# Altium project UdemyCourse.PrjPcb
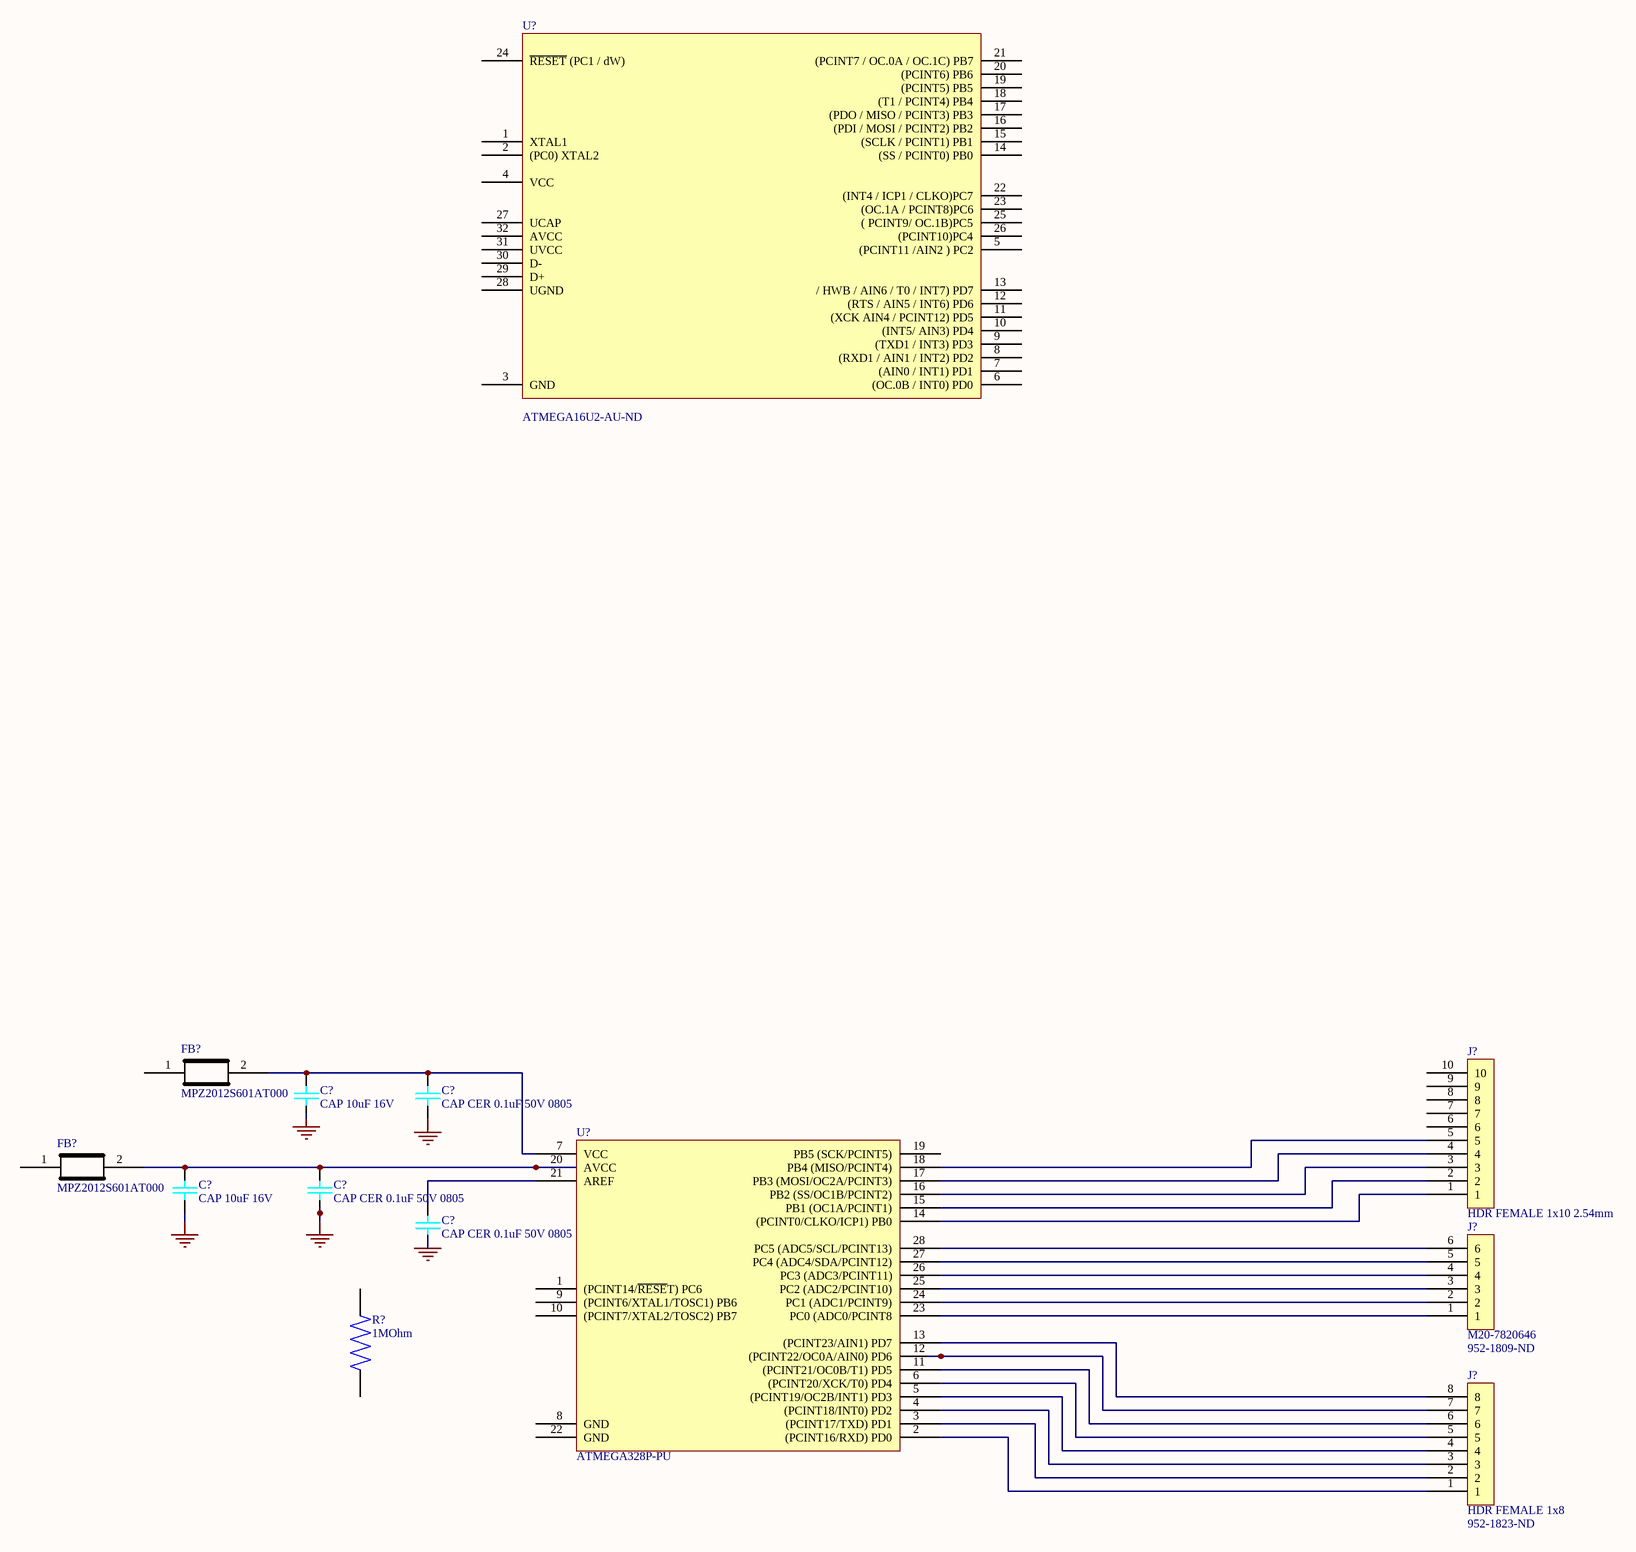
[diagram p0: 28Pins.SchDoc]
1 sheet, 13 parts. Net scope: global (net labels, ports and power ports of the same name join across sheets).
Board file: 28Pin_PCB.PcbDoc

## Sheet 28Pins.SchDoc
size A0

### Parts
(Parts that share a designator on the sheet are numbered #1, #2 ... from top to bottom, then left to right.)
C?#1  CAP 10uF 16V  [C0805_10uF]
C?#2  CAP CER 0.1uF 50V 0805  [C0805]
C?#3  CAP 10uF 16V  [C0805_10uF]
C?#4  CAP CER 0.1uF 50V 0805  [C0805]
C?#5  CAP CER 0.1uF 50V 0805  [C0805]
FB?#1  MPZ2012S601AT000  [C0805]
FB?#2  MPZ2012S601AT000  [C0805]
J?#1  HDR FEMALE 1x10 2.54mm  [HDR_FEMALE_1x10 - duplicate]
J?#2  M20-7820646  Supplier Part Number 1: 952-1809-ND
J?#3  HDR FEMALE 1x8  Supplier Part Number 1: 952-1823-ND  [HDR_FEMALE_1x8]
R?  1MOhm  [RESC2012X65N]
U?#1  Supplier Part Number 1: ATMEGA16U2-AU-ND  [TQFP32]
U?#2  ATMEGA328P-PU  [DIP28_328P]

### Nets
GND: C?#1.1 C?#3.1 C?#4.1 C?#5.1
k: C?#2.1
NetC?#1_2: C?#1.2 C?#2.2 FB?#1.2 U?#2.7(VCC)
NetC?#3_2: C?#3.2 C?#4.2 FB?#2.2 U?#2.20(AVCC)
NetC?#5_2: C?#5.2 U?#2.21(AREF)
NetJ?#1_1: J?#1.1 U?#2.14((PCINT0/CLKO/ICP1)_PB0)
NetJ?#1_2: J?#1.2 U?#2.15(PB1_(OC1A/PCINT1))
NetJ?#1_3: J?#1.3 U?#2.16(PB2_(SS/OC1B/PCINT2))
NetJ?#1_4: J?#1.4 U?#2.17(PB3_(MOSI/OC2A/PCINT3))
NetJ?#1_5: J?#1.5 U?#2.18(PB4_(MISO/PCINT4))
NetJ?#2_1: J?#2.1 U?#2.23(PC0_(ADC0/PCINT8)
NetJ?#2_2: J?#2.2 U?#2.24(PC1_(ADC1/PCINT9))
NetJ?#2_3: J?#2.3 U?#2.25(PC2_(ADC2/PCINT10))
NetJ?#2_4: J?#2.4 U?#2.26(PC3_(ADC3/PCINT11))
NetJ?#2_5: J?#2.5 U?#2.27(PC4_(ADC4/SDA/PCINT12))
NetJ?#2_6: J?#2.6 U?#2.28(PC5_(ADC5/SCL/PCINT13))
NetJ?#3_1: J?#3.1 U?#2.2((PCINT16/RXD)_PD0)
NetJ?#3_2: J?#3.2 U?#2.3((PCINT17/TXD)_PD1)
NetJ?#3_3: J?#3.3 U?#2.4((PCINT18/INT0)_PD2)
NetJ?#3_4: J?#3.4 U?#2.5((PCINT19/OC2B/INT1)_PD3)
NetJ?#3_5: J?#3.5 U?#2.6((PCINT20/XCK/T0)_PD4)
NetJ?#3_6: J?#3.6 U?#2.11((PCINT21/OC0B/T1)_PD5)
NetJ?#3_7: J?#3.7 U?#2.12((PCINT22/OC0A/AIN0)_PD6)
NetJ?#3_8: J?#3.8 U?#2.13((PCINT23/AIN1)_PD7)

Not connected (* = marked no-connect by the designer): FB?#1 1; FB?#2 1; J?#1 6 7 8 9 10; R? 1 2; U?#1 1(XTAL1) 2((PC0)_XTAL2) 3(GND) 4(VCC) 5((PCINT11_/AIN2_)_PC2) 6((OC.0B_/_INT0)_PD0) 7((AIN0_/_INT1)_PD1) 8((RXD1_/_AIN1_/_INT2)_PD2) 9((TXD1_/_INT3)_PD3) 10((INT5/_AIN3)_PD4) 11((XCK_AIN4_/_PCINT12)_PD5) 12((RTS_/_AIN5_/_INT6)_PD6) 13(/_HWB_/_AIN6_/_T0_/_INT7)_PD7) 14((SS_/_PCINT0)_PB0) 15((SCLK_/_PCINT1)_PB1) 16((PDI_/_MOSI_/_PCINT2)_PB2) 17((PDO_/_MISO_/_PCINT3)_PB3) 18((T1_/_PCINT4)_PB4) 19((PCINT5)_PB5) 20((PCINT6)_PB6) 21((PCINT7_/_OC.0A_/_OC.1C)_PB7) 22((INT4_/_ICP1_/_CLKO)PC7) 23((OC.1A_/_PCINT8)PC6) 24(~{RESET}_(PC1_/_dW)) 25((_PCINT9/_OC.1B)PC5) 26((PCINT10)PC4) 27(UCAP) 28(UGND) 29(D+) 30(D-) 31(UVCC) 32(AVCC); U?#2 1((PCINT14/~{RESE}T)_PC6) 8(GND) 9((PCINT6/XTAL1/TOSC1)_PB6) 10((PCINT7/XTAL2/TOSC2)_PB7) 19(PB5_(SCK/PCINT5)) 22(GND)

### Library data of the parts
C?#1 C?#3 = CGA4J1X5R1C106K125AC: TDK - CGA4J1X5R1C106K125AC - Keramikvielschichtkondensator, SMD, 10 µF, 16 V, 0805 [Metrisch 2012], ± 10%, X5R, Baureihe CGA; Supplier 1: Digi-Key; Manufacturer: TDK; Manufacturer Part Number: CGA4J1X5R1C106K125AC; RoHS: Yes; Category: Ceramic Capacitors; Stock 1: 1670; Pricing 1: 1=0.48000, 10=0.33000, 50=0.23100, 100=0.19800, 500=0.14850, 1000=0.12540 (USD); Mount: Surface Mount; Case/Package: 0805; Case Code (Metric): 2012; Case Code (Imperial): 0805; Weight: 0.000194oz; Min Operating Temperature: -55°C; Max Operating Temperature: 85°C; Capacitance: 10uF; Tolerance: 10%; Voltage Rating: 16V; Package Quantity: 1; Packaging: Tape and Reel; Voltage Rating (DC): 16V; Dielectric: X5R; Termination: SMD/SMT; Resistor Type: Ceramic; Series: CGA; Length: 2mm; Width: 0.049inch; Height: 1.25mm; Thickness: 0.049inch; Depth: 1.25mm; Ratings: AEC-Q200; REACH SVHC: No SVHC; Lead Free: Lead Free; RoHS Compliant: Yes; ComponentLink1URL: https://datasheet.ciiva.com/24216/cga4j1x5r1c106k125ac-265827-24216314.pdf?src-supplier=Mouser; ComponentLink1Description: https://datasheet.ciiva.com/24216/cga4j1x5r1c106k125ac-265827-24216314.pdf?src-supplier=Mouser; ComponentLink2URL: https://datasheet.ciiva.com/7975/1807242-7975419.pdf?src-supplier=Element14; ComponentLink2Description: https://datasheet.ciiva.com/7975/1807242-7975419.pdf?src-supplier=Element14; Supplier Part Number 1: 445-7883-1-ND
C?#2 C?#4 C?#5 = CGA4J2X7R1H104K125AE: CAP CER 0.1UF 50V X7R 0805; Manufacturer: TDK; Capacitance: 100nF; Tolerance: 10%; Supplier 1: Digi-Key; Manufacturer Part Number: CGA4J2X7R1H104K125AE; RoHS: Yes; Category: Ceramic Capacitors; Stock 1: 29752; Pricing 1: 1=0.26000, 10=0.18200, 50=0.12100, 100=0.10280, 500=0.07260, 1000=0.06352 (USD); Mount: Surface Mount; Case/Package: 0805; Case Code (Metric): 2012; Case Code (Imperial): 0805; Min Operating Temperature: -55°C; Max Operating Temperature: 125°C; Package Quantity: 1; Packaging: Tape and Reel; Voltage Rating: 50V; Features: Soft Termination; Length: 0.079inch; Width: 0.049inch; Thickness: 0.057inch; Ratings: AEC-Q200; Lead Free: Lead Free; RoHS Compliant: Yes; ComponentLink1URL: http://product.tdk.com/en/catalog/datasheets/mlcc_automotive_soft_en.pdf?src-supplier=Avnet; ComponentLink1Description: http://product.tdk.com/en/catalog/datasheets/mlcc_automotive_soft_en.pdf?src-supplier=Avnet; ComponentLink2URL: https://product.tdk.com/info/en/catalog/datasheets/mlcc_automotive_soft_en.pdf?src-supplier=Digi-Key; ComponentLink2Description: https://product.tdk.com/info/en/catalog/datasheets/mlcc_automotive_soft_en.pdf?src-supplier=Digi-Key; ComponentLink3URL: https://product.tdk.com/info/en/catalog/spec/mlccspec_automotive_soft_en.pdf?src-supplier=Digi-Key; ComponentLink3Description: https://product.tdk.com/info/en/catalog/spec/mlccspec_automotive_soft_en.pdf?src-supplier=Digi-Key; Supplier Part Number 1: 445-15959-1-ND
FB?#1 FB?#2 = MPZ2012S601AT000: FERRITE BEAD 600 OHM 0805 1LN; Manufacturer: TDK; Impedance: 600R; Current Rating: 2A; DC Resistance (DCR): 100mR; Supplier 1: Digi-Key; Manufacturer Part Number: MPZ2012S601AT000; RoHS: Yes; Category: Ferrite Beads and Chips; Pricing 1: 1=0.11000, 10=0.09200, 25=0.08240, 50=0.06040, 100=0.05220, 250=0.04116, 500=0.03476, 1000=0.02928 (USD); Mount: Surface Mount; Case/Package: 0805; Case Code (Metric): 2012; Case Code (Imperial): 0805; Packaging: Tape and Reel; Package Quantity: 1; Max DC Current: 2A; Series: MPZ; Length: 0.079inch; Width: 0.049inch; Height: 0.041inch; REACH SVHC: No SVHC; Lead Free: Lead Free; RoHS Compliant: Yes; ComponentLink1URL: https://datasheet.ciiva.com/46634/beads-commercial-power-mpz-en-46634377.pdf?src-supplier=Digi-Key; ComponentLink1Description: https://datasheet.ciiva.com/46634/beads-commercial-power-mpz-en-46634377.pdf?src-supplier=Digi-Key; ComponentLink2URL: https://datasheet.ciiva.com/46634/beads-commercial-power-mpz-en-46634606.pdf?src-supplier=Digi-Key; ComponentLink2Description: https://datasheet.ciiva.com/46634/beads-commercial-power-mpz-en-46634606.pdf?src-supplier=Digi-Key; ComponentLink3URL: https://datasheet.ciiva.com/46634/beads-commercial-power-mpz-en-46634335.pdf?src-supplier=Digi-Key; ComponentLink3Description: https://datasheet.ciiva.com/46634/beads-commercial-power-mpz-en-46634335.pdf?src-supplier=Digi-Key; Supplier Part Number 1: 445-2206-1-ND
J?#1 = 952-3580-ND (female header 10pin): Supplier 1: Digi-Key; Supplier Part Number 1: 952-1847-ND
J?#2 = M20-7820646: 06-WAY SIL VERT SOCKET L/FREE; Manufacturer: Harwin; Number of Contacts: 6; Max Current Rating: 3A; Contact Resistance: 20mR; Connector Type: Receptacle; Gender: Female; Pitch: 2.54mm; Supplier 1: Digi-Key; Manufacturer Part Number: M20-7820646; RoHS: Yes; Category: Headers and Wire Housings; Stock 1: 1269; Pricing 1: 1=1.02000, 10=0.89900, 100=0.77550, 500=0.63448, 1000=0.56398, 5000=0.49349, 10000=0.46881 (USD); Mount: Through Hole; Case/Package: SIL; Color: Black; Contact Plating: Tin; Contact Material: Bronze; Housing Color: Black; Housing Material: Nylon; Min Operating Temperature: -40°C; Max Operating Temperature: 105°C; Number of Rows: 1; Termination: Solder; Packaging: Rail/Tube; Contact Gender: Female; Package Quantity: 38; Number of Positions: 6; Orientation: Straight; Series: M20; Contact Type: Female Socket; Length: 15.64mm; Depth: 2.5mm; Radiation Hardening: No; RoHS Compliant: Yes; ComponentLink1URL: http://components.arrow.com/part/dataview/0323_00725884?src-supplier=Arrow+Europe; ComponentLink1Description: http://components.arrow.com/part/dataview/0323_00725884?src-supplier=Arrow+Europe; ComponentLink2URL: http://www.harwin.com/include/downloads/pdfs/2010PAGE120.PDF?src-supplier=Avnet; ComponentLink2Description: http://www.harwin.com/include/downloads/pdfs/2010PAGE120.PDF?src-supplier=Avnet; ComponentLink3URL: https://cdn.harwin.com/pdfs/M20-782.pdf?src-supplier=Digi-Key; ComponentLink3Description: https://cdn.harwin.com/pdfs/M20-782.pdf?src-supplier=Digi-Key; ComponentLink4URL: https://cdn.harwin.com/pdfs/Harwin_PC_Connectors_M20.pdf?src-supplier=Avnet+Europe; ComponentLink4Description: https://cdn.harwin.com/pdfs/Harwin_PC_Connectors_M20.pdf?src-supplier=Avnet+Europe; ComponentLink5URL: https://cdn.harwin.com/pdfs/Harwin_PC_Connectors_M20.pdf?src-supplier=RSComponents; ComponentLink5Description: https://cdn.harwin.com/pdfs/Harwin_PC_Connectors_M20.pdf?src-supplier=RSComponents; ComponentLink6URL: https://cdn.harwin.com/pdfs/Harwin_PC_Connectors_M20.pdf?src-supplier=Mouser; ComponentLink6Description: https://cdn.harwin.com/pdfs/Harwin_PC_Connectors_M20.pdf?src-supplier=Mouser; ComponentLink7URL: https://cdn.harwin.com/pdfs/Harwin_PC_Connectors_M20.pdf?src-supplier=TTI; ComponentLink7Description: https://cdn.harwin.com/pdfs/Harwin_PC_Connectors_M20.pdf?src-supplier=TTI
J?#3 = M20-7821046: HARWIN - M20-7821046 - Board-To-Board Connector, M20 Series, Through Hole, Receptacle, 10, 2.54 mm, Tin Plated Contacts; Connector Type: Receptacle,Socket; Number of Positions: 10; Current Rating: 3A; Insulation Resistance: 1MR; Contact Resistance: 20mR; Mating Cycles: 50; Pitch: 2.54mm; Hole Diameter: 0.8mm; Manufacturer: Harwin; Manufacturer Part Number: M20-7821046; RoHS: Yes; Category: Headers and Wire Housings; Stock 1: 664; Pricing 1: 1=1.29000, 10=1.13300, 100=0.97770, 500=0.79992, 1000=0.71104, 5000=0.62216, 10000=0.59105 (USD); Mount: Through Hole; Case/Package: SIL; Color: Black; Contact Plating: Tin; Contact Material: Bronze; Housing Material: Polyamide; Housing Color: Black; Min Operating Temperature: -40°C; Max Operating Temperature: 105°C; Termination: Solder; Packaging: Rail/Tube; Number of Rows: 1; Package Quantity: 23; Number of Contacts: 10; Gender: Receptacle; Orientation: Straight; Max Current Rating: 3A; Contact Gender: Female; Length: 25.8mm; Depth: 2.5mm; Lead Pitch: 2.54mm; Radiation Hardening: No; REACH SVHC: No SVHC; ComponentLink1URL: https://datasheet.ciiva.com/26899/getdatasheetpartid-559226-26899379.pdf?src-supplier=Verical; ComponentLink1Description: https://datasheet.ciiva.com/26899/getdatasheetpartid-559226-26899379.pdf?src-supplier=Verical; ComponentLink2URL: https://datasheet.ciiva.com/11753/0900766b80dc1d2b-11753869.pdf?src-supplier=RSComponents; ComponentLink2Description: https://datasheet.ciiva.com/11753/0900766b80dc1d2b-11753869.pdf?src-supplier=RSComponents; ComponentLink3URL: https://datasheet.ciiva.com/6785/m20-782-6785605.pdf?src-supplier=Digi-Key; ComponentLink3Description: https://datasheet.ciiva.com/6785/m20-782-6785605.pdf?src-supplier=Digi-Key; ComponentLink4URL: https://datasheet.ciiva.com/10151/m20-782-10151366.pdf?src-supplier=Avnet; ComponentLink4Description: https://datasheet.ciiva.com/10151/m20-782-10151366.pdf?src-supplier=Avnet; ComponentLink5URL: https://datasheet.ciiva.com/16732/m20-782-16732152.pdf?src-supplier=Avnet+Europe; ComponentLink5Description: https://datasheet.ciiva.com/16732/m20-782-16732152.pdf?src-supplier=Avnet+Europe; Supplier 1: Digi-Key
R? = RMCF0805FG1M00: Package: None; Price: None; Value: *; MP: RMCF0805FG1M00; Availability: Unavailable; Supplier 1: Digi-Key; Supplier Part Number 1: RMCF0805FG1M00CT-ND
U?#1 = ATMEGA16U2-AU: MICROCHIP - ATMEGA16U2-AU - MCU, 8BIT, MEGAAVR, 16MHZ, TQFP-32; Manufacturer: Microchip / Atmel; Core Architecture: AVR; Interface: SPI,UART,USB,USART,Serial; Data Bus Width: 8b; Memory Type: FLASH; Memory Size: 16KB; RAM Size: 512B; Number of I/Os: 22; Number of Timers/Counters: 2; Max Supply Voltage: 5.5V; Min Supply Voltage: 2.7V; Oscillator Type: Internal; Watchdog Timer: Yes; Peripherals: Brown-out Detect/Reset,POR,PWM,WDT; Number of PWM Channels: 5; Number of SPI Channels: 1; Supplier 1: Digi-Key; Manufacturer Part Number: ATMEGA16U2-AU; RoHS: Yes; Category: Microcontrollers; Stock 1: 4215; Pricing 1: 1=2.83000, 25=2.59600, 100=2.35400 (USD); Mount: Surface Mount; Case/Package: A; Number of Pins: 32; Min Operating Temperature: -40°C; Max Operating Temperature: 85°C; Package Quantity: 1250; Frequency: 16MHz; Packaging: Tray; Number of Programmable I/O: 22; Max Frequency: 16MHz; Series: AVR® ATmega; Length: 7mm; Width: 7mm; Height: 1.05mm; REACH SVHC: No SVHC; Lead Free: Lead Free; RoHS Compliant: Yes; ComponentLink1URL: https://datasheet.ciiva.com/13036/doc7799-28769-13036800.pdf?src-supplier=Mouser; ComponentLink1Description: https://datasheet.ciiva.com/13036/doc7799-28769-13036800.pdf?src-supplier=Mouser; ComponentLink2URL: https://datasheet.ciiva.com/22651/doc7799-22651110.pdf?src-supplier=Farnell; ComponentLink2Description: https://datasheet.ciiva.com/22651/doc7799-22651110.pdf?src-supplier=Farnell; Contact Plating: Tin,Matte
U?#2 = ATMEGA328P-PU: IC MCU 8BIT 32KB FLASH 28DIP; Manufacturer: Microchip / Atmel; Core Architecture: AVR; Number of I/Os: 23; Frequency: 20MHz; Oscillator Type: Internal; Peripherals: Brown-out Detect/Reset,POR,PWM,WDT; Interface: I2C,SPI,UART,USART,2-Wire; RAM Size: 2KB; Number of Timers/Counters: 3; Min Supply Voltage: 1.8V; Max Supply Voltage: 5.5V; Data Bus Width: 8b; Watchdog Timer: Yes; Number of PWM Channels: 6; Number of SPI Channels: 1; Supplier 1: Digi-Key; Manufacturer Part Number: ATMEGA328P-PU; RoHS: Yes; Category: Microcontrollers; Stock 1: 54032; Pricing 1: 1=2.52000, 25=2.31000, 100=2.09000 (USD); Mount: Through Hole; Case/Package: PDIP; Number of Pins: 28; Contact Plating: Tin,Matte; Min Operating Temperature: -40°C; Max Operating Temperature: 85°C; Packaging: Rail/Tube; Memory Type: FLASH; Memory Size: 32KB; Package Quantity: 14; Number of Programmable I/O: 23; Max Frequency: 20MHz; Series: AVR® ATmega; Number of ADC Channels: 6; Number of I2C Channels: 1; Length: 37.4mm; Width: 6.76mm; Height: 3.28mm; Radiation Hardening: No; RoHS Compliant: Yes; Lead Free: Lead Free; REACH SVHC: No SVHC; ComponentLink1URL: https://datasheet.ciiva.com/19457/2139111-19457070.pdf?src-supplier=Jameco; ComponentLink1Description: https://datasheet.ciiva.com/19457/2139111-19457070.pdf?src-supplier=Jameco; ComponentLink2URL: https://datasheet.ciiva.com/1157/1684409-1157696.pdf?src-supplier=Element14; ComponentLink2Description: https://datasheet.ciiva.com/1157/1684409-1157696.pdf?src-supplier=Element14; ComponentLink3URL: https://datasheet.ciiva.com/20168/73-4283-20168380.pdf?src-supplier=Rapid+Electronics; ComponentLink3Description: https://datasheet.ciiva.com/20168/73-4283-20168380.pdf?src-supplier=Rapid+Electronics; ComponentLink4URL: https://datasheet.ciiva.com/29119/155197-da-01-en-microcontr-atmega328p-pu-8bit-pdip-28-29119593.pdf?src-supplier=Conrad; ComponentLink4Description: https://datasheet.ciiva.com/29119/155197-da-01-en-microcontr-atmega328p-pu-8bit-pdip-28-29119593.pdf?src-supplier=Conrad; ComponentLink5URL: https://datasheet.ciiva.com/26818/atmega328p-pu-26818578.pdf?src-supplier=IIIC; ComponentLink5Description: https://datasheet.ciiva.com/26818/atmega328p-pu-26818578.pdf?src-supplier=IIIC; ComponentLink6URL: https://datasheet.ciiva.com/15213/getdatasheetpartid-318533-15213133.pdf?src-supplier=Verical; ComponentLink6Description: https://datasheet.ciiva.com/15213/getdatasheetpartid-318533-15213133.pdf?src-supplier=Verical; Supplier Part Number 1: ATMEGA328P-PU-ND